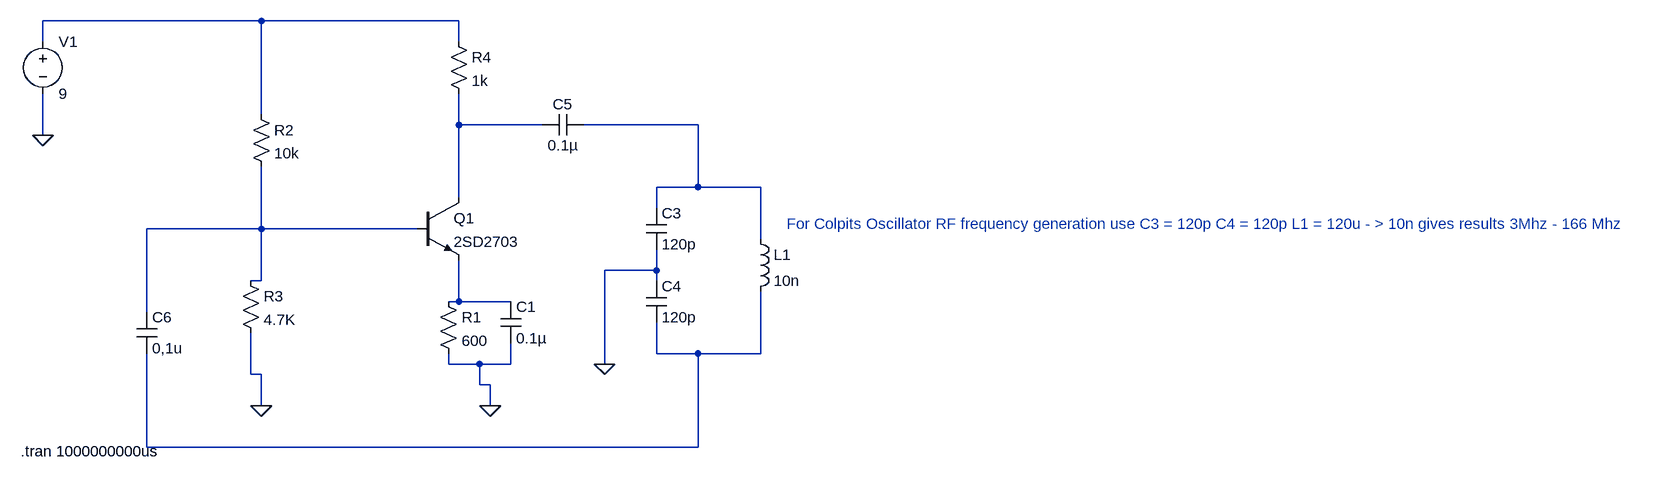
[diagram p0: schematic Oscillator schematic.asc]
Oscillator schematic.asc, the LTspice schematic file:
Version 4
SHEET 1 2164 680
WIRE -48 -160 -384 -160
WIRE 256 -160 -48 -160
WIRE -384 -128 -384 -160
WIRE 256 -128 256 -160
WIRE -48 -16 -48 -160
WIRE 256 0 256 -48
WIRE 384 0 256 0
WIRE 624 0 448 0
WIRE -384 16 -384 -48
WIRE 624 96 624 0
WIRE 624 96 560 96
WIRE 720 96 624 96
WIRE 256 112 256 0
WIRE 560 128 560 96
WIRE -48 160 -48 64
WIRE -48 160 -224 160
WIRE 192 160 -48 160
WIRE 720 176 720 96
WIRE 560 224 560 192
WIRE 560 224 480 224
WIRE -48 240 -48 160
WIRE -48 240 -64 240
WIRE 560 240 560 224
WIRE 256 272 256 208
WIRE 256 272 240 272
WIRE 336 272 256 272
WIRE -224 288 -224 160
WIRE 560 352 560 304
WIRE 624 352 560 352
WIRE 720 352 720 256
WIRE 720 352 624 352
WIRE 240 368 240 352
WIRE 288 368 240 368
WIRE 336 368 336 336
WIRE 336 368 288 368
WIRE 480 368 480 224
WIRE -64 384 -64 320
WIRE -48 384 -64 384
WIRE 288 400 288 368
WIRE 304 400 288 400
WIRE -48 432 -48 384
WIRE 304 432 304 400
WIRE -224 496 -224 352
WIRE 624 496 624 352
WIRE 624 496 -224 496
FLAG 304 432 0
FLAG -384 16 0
FLAG -48 432 0
FLAG 480 368 0
SYMBOL npn 192 112 R0
SYMATTR InstName Q1
SYMATTR Value 2SD2703
SYMBOL res 224 256 R0
SYMATTR InstName R1
SYMATTR Value 600
SYMBOL cap 320 272 R0
SYMATTR InstName C1
SYMATTR Value 0.1µ
SYMBOL res -64 -32 R0
SYMATTR InstName R2
SYMATTR Value 10k
SYMBOL res -80 224 R0
SYMATTR InstName R3
SYMATTR Value 4.7K
SYMBOL res 240 -144 R0
SYMATTR InstName R4
SYMATTR Value 1k
SYMBOL voltage -384 -144 R0
WINDOW 123 0 0 Left 0
WINDOW 39 0 0 Left 0
SYMATTR InstName V1
SYMATTR Value 9
SYMBOL cap 448 -16 R90
WINDOW 0 0 32 VBottom 2
WINDOW 3 32 32 VTop 2
SYMATTR InstName C5
SYMATTR Value 0.1µ
SYMBOL cap 544 128 R0
SYMATTR InstName C3
SYMATTR Value 120p
SYMBOL cap 544 240 R0
SYMATTR InstName C4
SYMATTR Value 120p
SYMBOL ind 704 160 R0
SYMATTR InstName L1
SYMATTR Value 10n
SYMBOL cap -240 288 R0
SYMATTR InstName C6
SYMATTR Value 0,1u
TEXT -418 502 Left 2 !.tran 1000000000us
TEXT 760 152 Left 2 ;For Colpits Oscillator RF frequency generation use C3 = 120p C4 = 120p L1 = 120u - > 10n gives results 3Mhz - 166 Mhz

The netlist it stands for:
* Oscillator schematic.asc
Q1 N002 N004 N005 0 2SD2703
R1 N005 0 600
C1 N005 0 0.1µ
R2 N001 N004 10k
R3 N004 0 4.7K
R4 N001 N002 1k
V1 N001 0 9
C5 N003 N002 0.1µ
C3 N003 0 120p
C4 0 N006 120p
L1 N003 N006 10n
C6 N004 N006 0,1u
.model NPN NPN
.model PNP PNP
.lib standard.bjt
.tran 1000000000us
* For Colpits Oscillator RF frequency generation use C3 = 120p C4 = 120p L1 = 120u - > 10n gives results 3Mhz - 166 Mhz
.backanno
.end